# Altium schematic sheet Kalibracija4.SchDoc
size A4
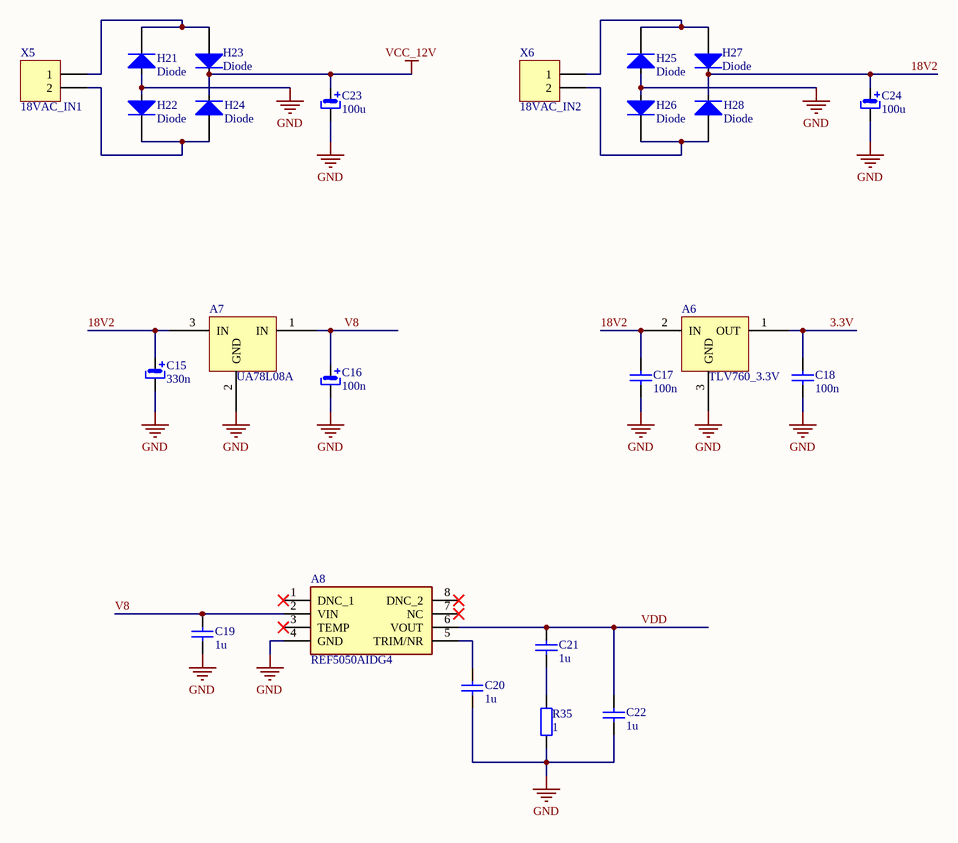
[diagram p0: Kalibracija4.SchDoc]

## Parts
A6  TLV760_3.3V
A7  UA78L08A  [TO-92]
A8  REF5050AIDG4  [SOIC127P600X175-8N]
C15  330n
C16  100n
C17  100n  [6-0805_N]
C18  100n  [6-0805_N]
C19  1u  [6-0805_N]
C20  1u  [6-0805_N]
C21  1u  [6-0805_N]
C22  1u  [6-0805_N]
C23  100u
C24  100u
H21  Diode  [SMC]
H22  Diode  [SMC]
H23  Diode  [SMC]
H24  Diode  [SMC]
H25  Diode  [SMC]
H26  Diode  [SMC]
H27  Diode  [SMC]
H28  Diode  [SMC]
R35  1  [6-0805_N]
X5  18VAC_IN1  [HDR1X2]
X6  18VAC_IN2  [HDR1X2]

## Nets
GND: A6.3(GND) A7.2(GND) A8.4(GND) C15.2 C16.2 C17.1 C18.1 C19.1 C20.1 C22.1 C23.2 C24.2 H21.1(A) H22.1(A) H25.1(A) H26.1(A) R35.1
VCC_12V: C23.1 H23.2(K) H24.2(K)
3.3V: A6.1(OUT) C18.2
18V2: A6.2(IN) A7.3(IN) C15.1 C17.2 C24.1 H27.2(K) H28.2(K)
V8: A7.1(IN) A8.2(VIN) C16.1 C19.2
VDD: A8.6(VOUT) C21.2 C22.2
NetA8_5: A8.5(TRIM/NR) C20.2
NetC21_1: C21.1 R35.2
NetH21_2: H21.2(K) H23.1(A) X5.1
NetH22_2: H22.2(K) H24.1(A) X5.2
NetH25_2: H25.2(K) H27.1(A) X6.1
NetH26_2: H26.2(K) H28.1(A) X6.2

Not connected (* = marked no-connect by the designer): A8 1(DNC_1)* 3(TEMP)* 7(NC)* 8(DNC_2)*

## Library data of the parts
A6 = TLV760
A8 = REF5050AIDG4: Integrated Circuit; Manufacturer_Name: Texas Instruments; Datasheet Link: http://www.ti.com/lit/ds/symlink/ref5050.pdf; Height: 1.75mm; Manufacturer_Part_Number: REF5050AIDG4; Mouser Part Number: 595-REF5050AIDG4; Mouser Price/Stock: https://www.mouser.com/Search/Refine.aspx?Keyword=595-REF5050AIDG4
C15 C16 C23 C24 = elko
C17-C22 = Cap: Capacitor; Value: 100pF; Published: 8-Jun-2000; LatestRevisionDate: 17-Jul-2002; LatestRevisionNote: Re-released for DXP Platform.; PackageReference: RAD-0.3; Publisher: Altium Limited; PackageDescription: Radial Cap, Thru-Hole; 2 Leads; 0.3 in Pin Spacing
H21-H28 = Diode: Default Diode; Published: 8-Jun-2000; LatestRevisionDate: 17-Jul-2002; LatestRevisionNote: Re-released for DXP Platform.; PackageVersion: Sep-1996; PackageReference: SMC; Publisher: Altium Limited; PackageDescription: DO-214-AB/SMC; 2 C-Bend Leads; Body 7.9 x 5.9 mm, inc. leads (LxW); Code_JEDEC: DO-214-AB
R35 = Res2: Resistor; Value: 1K; Published: 8-Jun-2000; LatestRevisionDate: 17-Jul-2002; LatestRevisionNote: Re-released for DXP Platform.; PackageReference: AXIAL-0.4; Publisher: Altium Limited; PackageDescription: Axial Device, Thru-Hole; 2 Leads; 0.4 in Pin Spacing
X5 X6 = Header 2H: Header, 2-Pin, Right Angle; LatestRevisionDate: 17-Jul-2002; LatestRevisionNote: Re-released for DXP Platform.; Publisher: Altium Limited